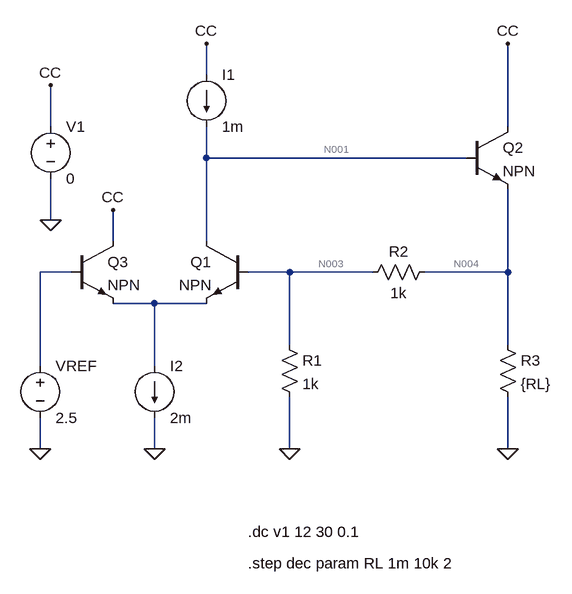
[diagram p0: schematic Regulador_Diferencial.asc]
Regulador_Diferencial.asc, the LTspice schematic file:
Version 4.1
SHEET 1 880 680
WIRE 240 -320 240 -368
WIRE 0 -240 0 -304
WIRE 704 -240 704 -368
WIRE 240 -192 240 -240
WIRE 640 -192 240 -192
WIRE 0 -96 0 -160
WIRE 96 -64 96 -112
WIRE 240 -64 240 -192
WIRE 32 -16 -16 -16
WIRE 368 -16 304 -16
WIRE 496 -16 368 -16
WIRE 704 -16 704 -144
WIRE 704 -16 576 -16
WIRE 160 32 96 32
WIRE 240 32 160 32
WIRE 368 96 368 -16
WIRE 704 96 704 -16
WIRE -16 128 -16 -16
WIRE 160 128 160 32
WIRE -16 256 -16 208
WIRE 160 256 160 208
WIRE 368 256 368 176
WIRE 704 256 704 176
FLAG 704 256 0
FLAG 368 256 0
FLAG 160 256 0
FLAG 0 -96 0
FLAG 0 -304 CC
FLAG 240 -368 CC
FLAG 704 -368 CC
FLAG 96 -112 CC
FLAG -16 256 0
SYMBOL npn 304 -64 M0
SYMATTR InstName Q1
SYMBOL npn 640 -240 R0
SYMATTR InstName Q2
SYMBOL voltage 0 -256 R0
WINDOW 123 0 0 Left 0
WINDOW 39 0 0 Left 0
SYMATTR InstName V1
SYMATTR Value 0
SYMBOL voltage -16 112 R0
WINDOW 123 0 0 Left 0
WINDOW 39 0 0 Left 0
SYMATTR InstName VREF
SYMATTR Value 2.5
SYMBOL res 352 80 R0
SYMATTR InstName R1
SYMATTR Value 1k
SYMBOL res 592 -32 R90
WINDOW 0 0 56 VBottom 2
WINDOW 3 32 56 VTop 2
SYMATTR InstName R2
SYMATTR Value 1k
SYMBOL res 688 80 R0
SYMATTR InstName R3
SYMATTR Value {RL}
SYMBOL npn 32 -64 R0
SYMATTR InstName Q3
SYMBOL current 160 128 R0
SYMATTR InstName I2
SYMATTR Value 2m
SYMBOL current 240 -320 R0
SYMATTR InstName I1
SYMATTR Value 1m
TEXT 304 384 Left 2 !.dc v1 12 30 0.1
TEXT 304 432 Left 2 !.step dec param RL 1m 10k 2

The netlist it stands for:
* Regulador_Diferencial.asc
Q1 N001 N003 N005 0 NPN
Q2 CC N001 N004 0 NPN
V1 CC 0 0
VREF N002 0 2.5
R1 N003 0 1k
R2 N004 N003 1k
R3 N004 0 {RL}
Q3 CC N002 N005 0 NPN
I2 N005 0 2m
I1 CC N001 1m
.model NPN NPN
.model PNP PNP
.lib standard.bjt
.dc v1 12 30 0.1
.step dec param RL 1m 10k 2
.backanno
.end

* Results of the author's LTspice run, read from the files saved beside the schematic
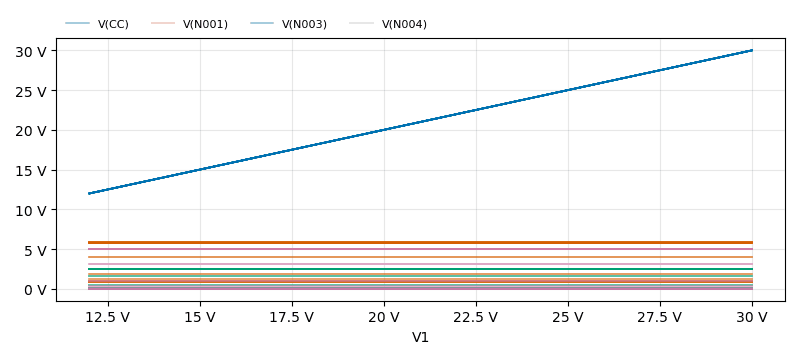
[diagram p1: DC transfer characteristic of Regulador_Diferencial.asc, plotted from the saved traces]
* DC transfer characteristic, 15 runs:
*   V(CC) [rl=0.001]: 12 V at V1=12 V, 30 V at V1=30 V, min 12 V, max 30 V
*   V(CC) [rl=0.00316227766016838]: 12 V at V1=12 V, 30 V at V1=30 V, min 12 V, max 30 V
*   V(CC) [rl=0.01]: 12 V at V1=12 V, 30 V at V1=30 V, min 12 V, max 30 V
*   V(CC) [rl=0.0316227766016838]: 12 V at V1=12 V, 30 V at V1=30 V, min 12 V, max 30 V
*   V(CC) [rl=0.1]: 12 V at V1=12 V, 30 V at V1=30 V, min 12 V, max 30 V
*   V(CC) [rl=0.316227766016838]: 12 V at V1=12 V, 30 V at V1=30 V, min 12 V, max 30 V
*   V(CC) [rl=1]: 12 V at V1=12 V, 30 V at V1=30 V, min 12 V, max 30 V
*   V(CC) [rl=3.16227766016838]: 12 V at V1=12 V, 30 V at V1=30 V, min 12 V, max 30 V
*   V(N001) [rl=0.001]: 893.4 mV at V1=12 V, 893.4 mV at V1=30 V, min 893.4 mV, max 893.4 mV
*   V(N001) [rl=0.00316227766016838]: 893.7 mV at V1=12 V, 893.7 mV at V1=30 V, min 893.7 mV, max 893.7 mV
*   V(N001) [rl=0.01]: 894.4 mV at V1=12 V, 894.4 mV at V1=30 V, min 894.4 mV, max 894.4 mV
*   V(N001) [rl=0.0316227766016838]: 896.5 mV at V1=12 V, 896.5 mV at V1=30 V, min 896.5 mV, max 896.5 mV
*   V(N001) [rl=0.1]: 903.4 mV at V1=12 V, 903.4 mV at V1=30 V, min 903.4 mV, max 903.4 mV
*   V(N001) [rl=0.316227766016838]: 925.3 mV at V1=12 V, 925.3 mV at V1=30 V, min 925.3 mV, max 925.3 mV
*   V(N001) [rl=1]: 994.3 mV at V1=12 V, 994.3 mV at V1=30 V, min 994.3 mV, max 994.3 mV
*   V(N001) [rl=3.16227766016838]: 1.212 V at V1=12 V, 1.212 V at V1=30 V, min 1.212 V, max 1.212 V
*   V(N003) [rl=0.001]: 50.5 µV at V1=12 V, 50.5 µV at V1=30 V, min 50.5 µV, max 50.5 µV
*   V(N003) [rl=0.00316227766016838]: 159.7 µV at V1=12 V, 159.7 µV at V1=30 V, min 159.7 µV, max 159.7 µV
*   V(N003) [rl=0.01]: 505 µV at V1=12 V, 505 µV at V1=30 V, min 505 µV, max 505 µV
*   V(N003) [rl=0.0316227766016838]: 1.597 mV at V1=12 V, 1.597 mV at V1=30 V, min 1.597 mV, max 1.597 mV
*   V(N003) [rl=0.1]: 5.05 mV at V1=12 V, 5.05 mV at V1=30 V, min 5.05 mV, max 5.05 mV
*   V(N003) [rl=0.316227766016838]: 15.97 mV at V1=12 V, 15.97 mV at V1=30 V, min 15.97 mV, max 15.97 mV
*   V(N003) [rl=1]: 50.47 mV at V1=12 V, 50.47 mV at V1=30 V, min 50.47 mV, max 50.47 mV
*   V(N003) [rl=3.16227766016838]: 159.4 mV at V1=12 V, 159.4 mV at V1=30 V, min 159.4 mV, max 159.4 mV
*   V(N004) [rl=0.001]: 101 µV at V1=12 V, 101 µV at V1=30 V, min 101 µV, max 101 µV
*   V(N004) [rl=0.00316227766016838]: 319.4 µV at V1=12 V, 319.4 µV at V1=30 V, min 319.4 µV, max 319.4 µV
*   V(N004) [rl=0.01]: 1.01 mV at V1=12 V, 1.01 mV at V1=30 V, min 1.01 mV, max 1.01 mV
*   V(N004) [rl=0.0316227766016838]: 3.194 mV at V1=12 V, 3.194 mV at V1=30 V, min 3.194 mV, max 3.194 mV
*   V(N004) [rl=0.1]: 10.1 mV at V1=12 V, 10.1 mV at V1=30 V, min 10.1 mV, max 10.1 mV
*   V(N004) [rl=0.316227766016838]: 31.93 mV at V1=12 V, 31.93 mV at V1=30 V, min 31.93 mV, max 31.93 mV
*   V(N004) [rl=1]: 100.9 mV at V1=12 V, 100.9 mV at V1=30 V, min 100.9 mV, max 100.9 mV
*   V(N004) [rl=3.16227766016838]: 318.9 mV at V1=12 V, 318.9 mV at V1=30 V, min 318.9 mV, max 318.9 mV